# EAGLE design probe_USB_1.1 (EAGLE 9.6.2)

## Sheet 1 of 3
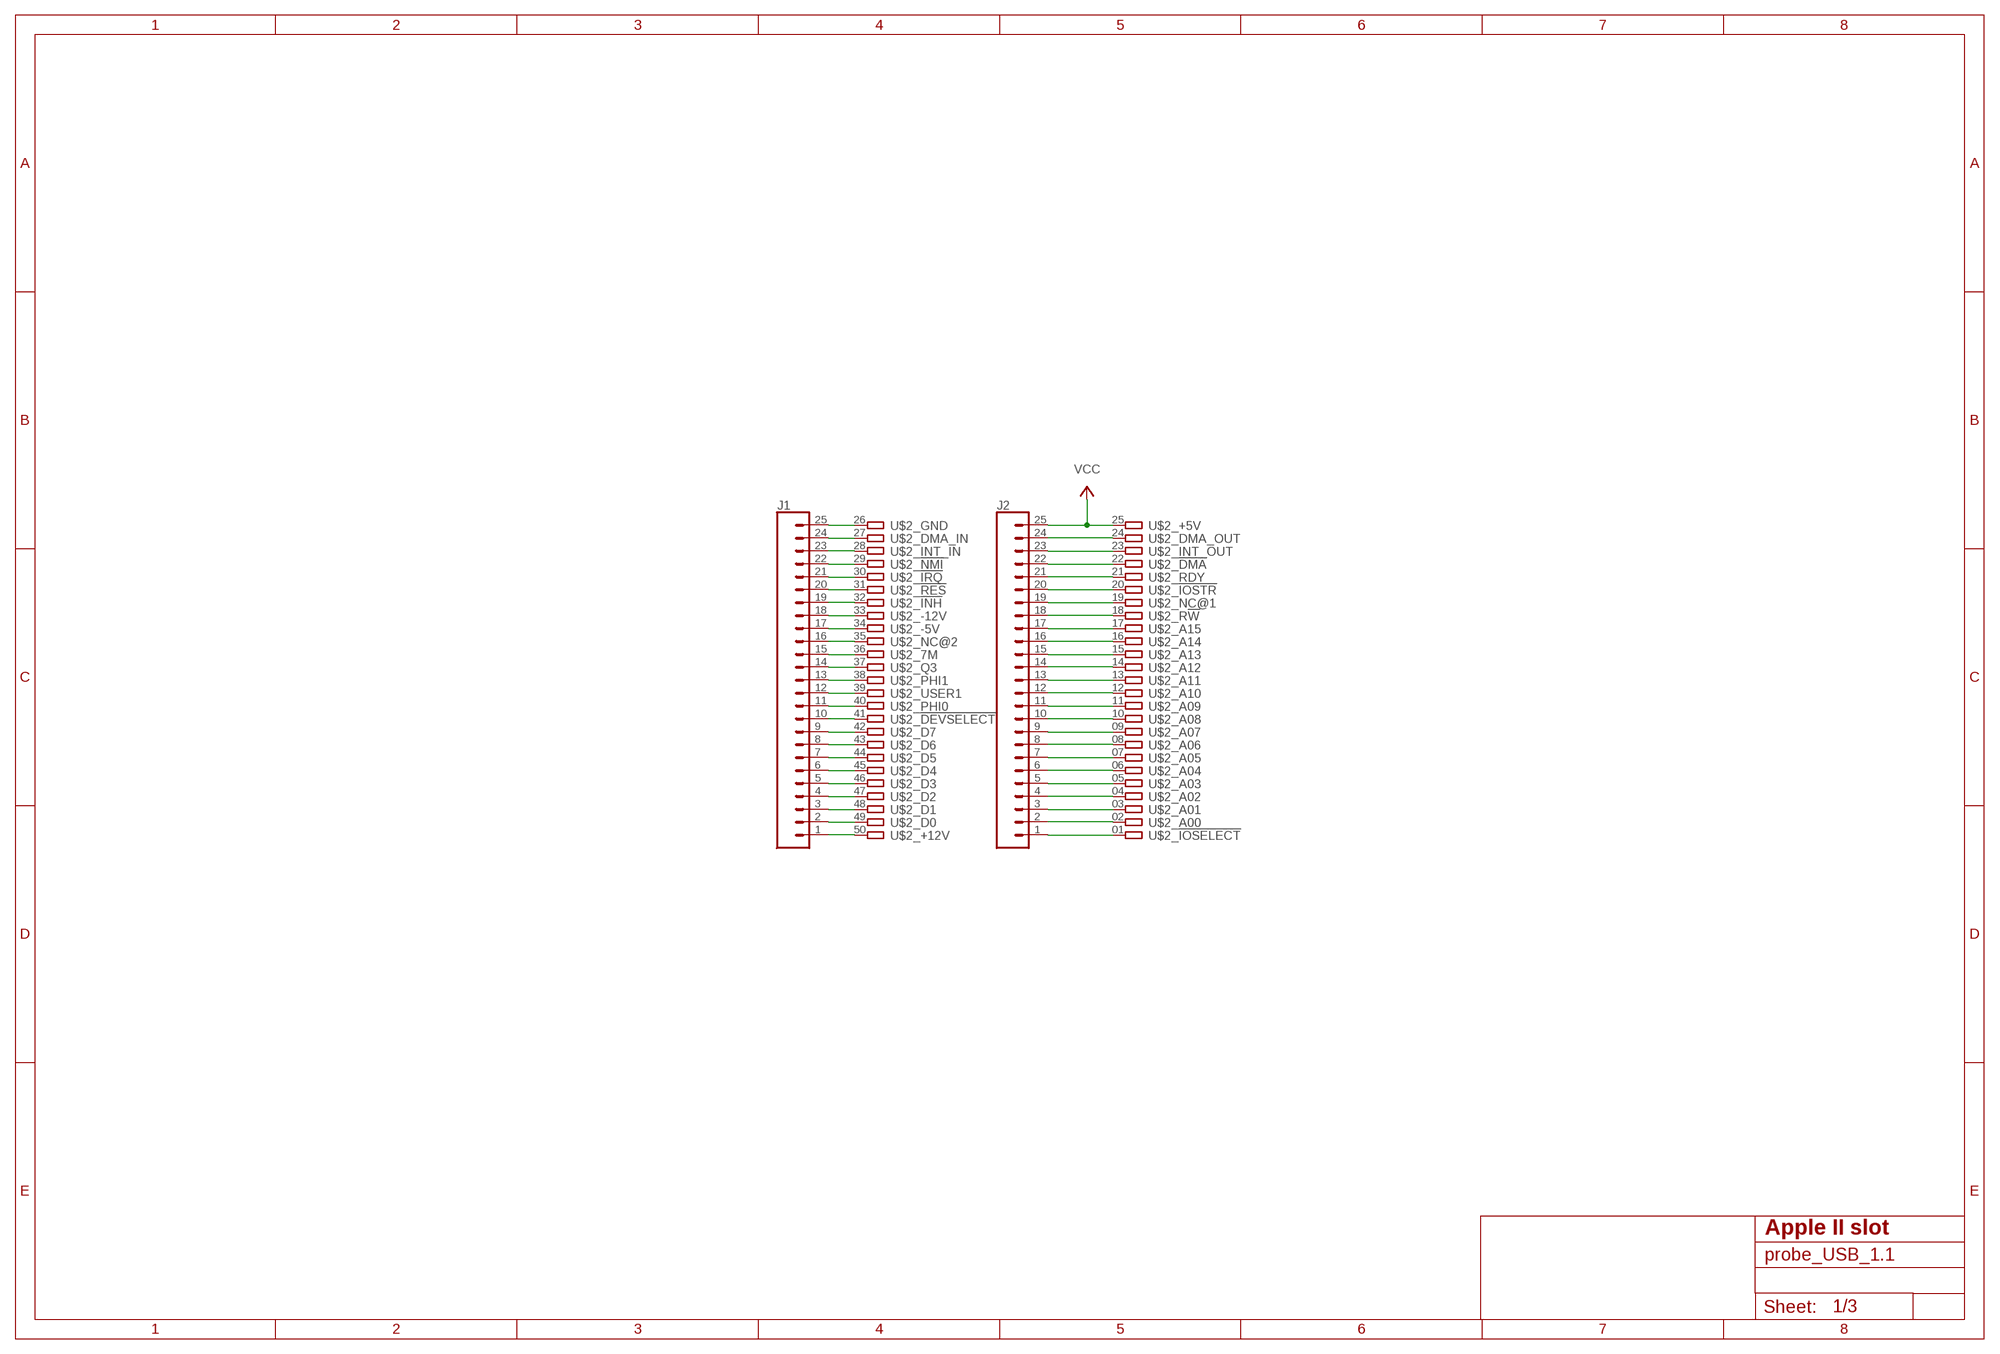
[diagram p0: schematic, sheet 1]

### Parts
J1  CONN_25PTH_LONGPADS  [1X25_LONGPAD]
J2  CONN_25PTH_LONGPADS  [1X25_LONGPAD]
U$2  A2-50PINSLOT1-3  [A2-50PIN-SL1-3]

### Nets
!CLKEN: J2.19 U$2.19
!DEV: J1.10 U$2.41 ; also sheet 3
!I/OSTROBE: J2.20 U$2.20
!IOSEL: J2.1 U$2.01 ; also sheet 3
!KBD: J1.16 U$2.35
!RES: J1.20 U$2.31 ; also sheet 3
+5V: J2.25 U$2.25 ; supply symbol labelled VCC ; also sheet 2,3
A0: J2.2 U$2.02 ; also sheet 3
A1: J2.3 U$2.03 ; also sheet 3
A2: J2.4 U$2.04 ; also sheet 3
A3: J2.5 U$2.05 ; also sheet 3
A4: J2.6 U$2.06 ; also sheet 3
A5: J2.7 U$2.07 ; also sheet 3
A6: J2.8 U$2.08 ; also sheet 3
A7: J2.9 U$2.09 ; also sheet 3
A8: J2.10 U$2.10 ; also sheet 3
A9: J2.11 U$2.11 ; also sheet 3
A10: J2.12 U$2.12 ; also sheet 3
A11: J2.13 U$2.13 ; also sheet 3
A12: J2.14 U$2.14 ; also sheet 3
A13: J2.15 U$2.15 ; also sheet 3
A14: J2.16 U$2.16 ; also sheet 3
A15: J2.17 U$2.17 ; also sheet 3
D0: J1.2 U$2.49 ; also sheet 3
D1: J1.3 U$2.48 ; also sheet 3
D2: J1.4 U$2.47 ; also sheet 3
D3: J1.5 U$2.46 ; also sheet 3
D4: J1.6 U$2.45 ; also sheet 3
D5: J1.7 U$2.44 ; also sheet 3
D6: J1.8 U$2.43 ; also sheet 3
D7: J1.9 U$2.42 ; also sheet 3
DMA_IN: J1.24 U$2.27
GND: J1.25 U$2.26 ; also sheet 2,3
INT_IN: J1.23 U$2.28
N$4: J1.22 U$2.29
N$27: J2.22 U$2.22
N$28: J2.23 U$2.23
N$29: J2.24 U$2.24
N$30: J1.21 U$2.30
N$32: J1.19 U$2.32
N$33: J1.18 U$2.33
N$34: J1.17 U$2.34
N$36: J1.15 U$2.36
N$37: J1.14 U$2.37
N$50: J1.1 U$2.50
PHI0: J1.11 U$2.40 ; also sheet 3
PHI1: J1.13 U$2.38 ; also sheet 3
R/!W: J2.18 U$2.18 ; also sheet 3
RDY: J2.21 U$2.21 ; also sheet 3
SYNC: J1.12 U$2.39 ; also sheet 3

### Notes on the sheet
- Apple II slot

## Sheet 2 of 3
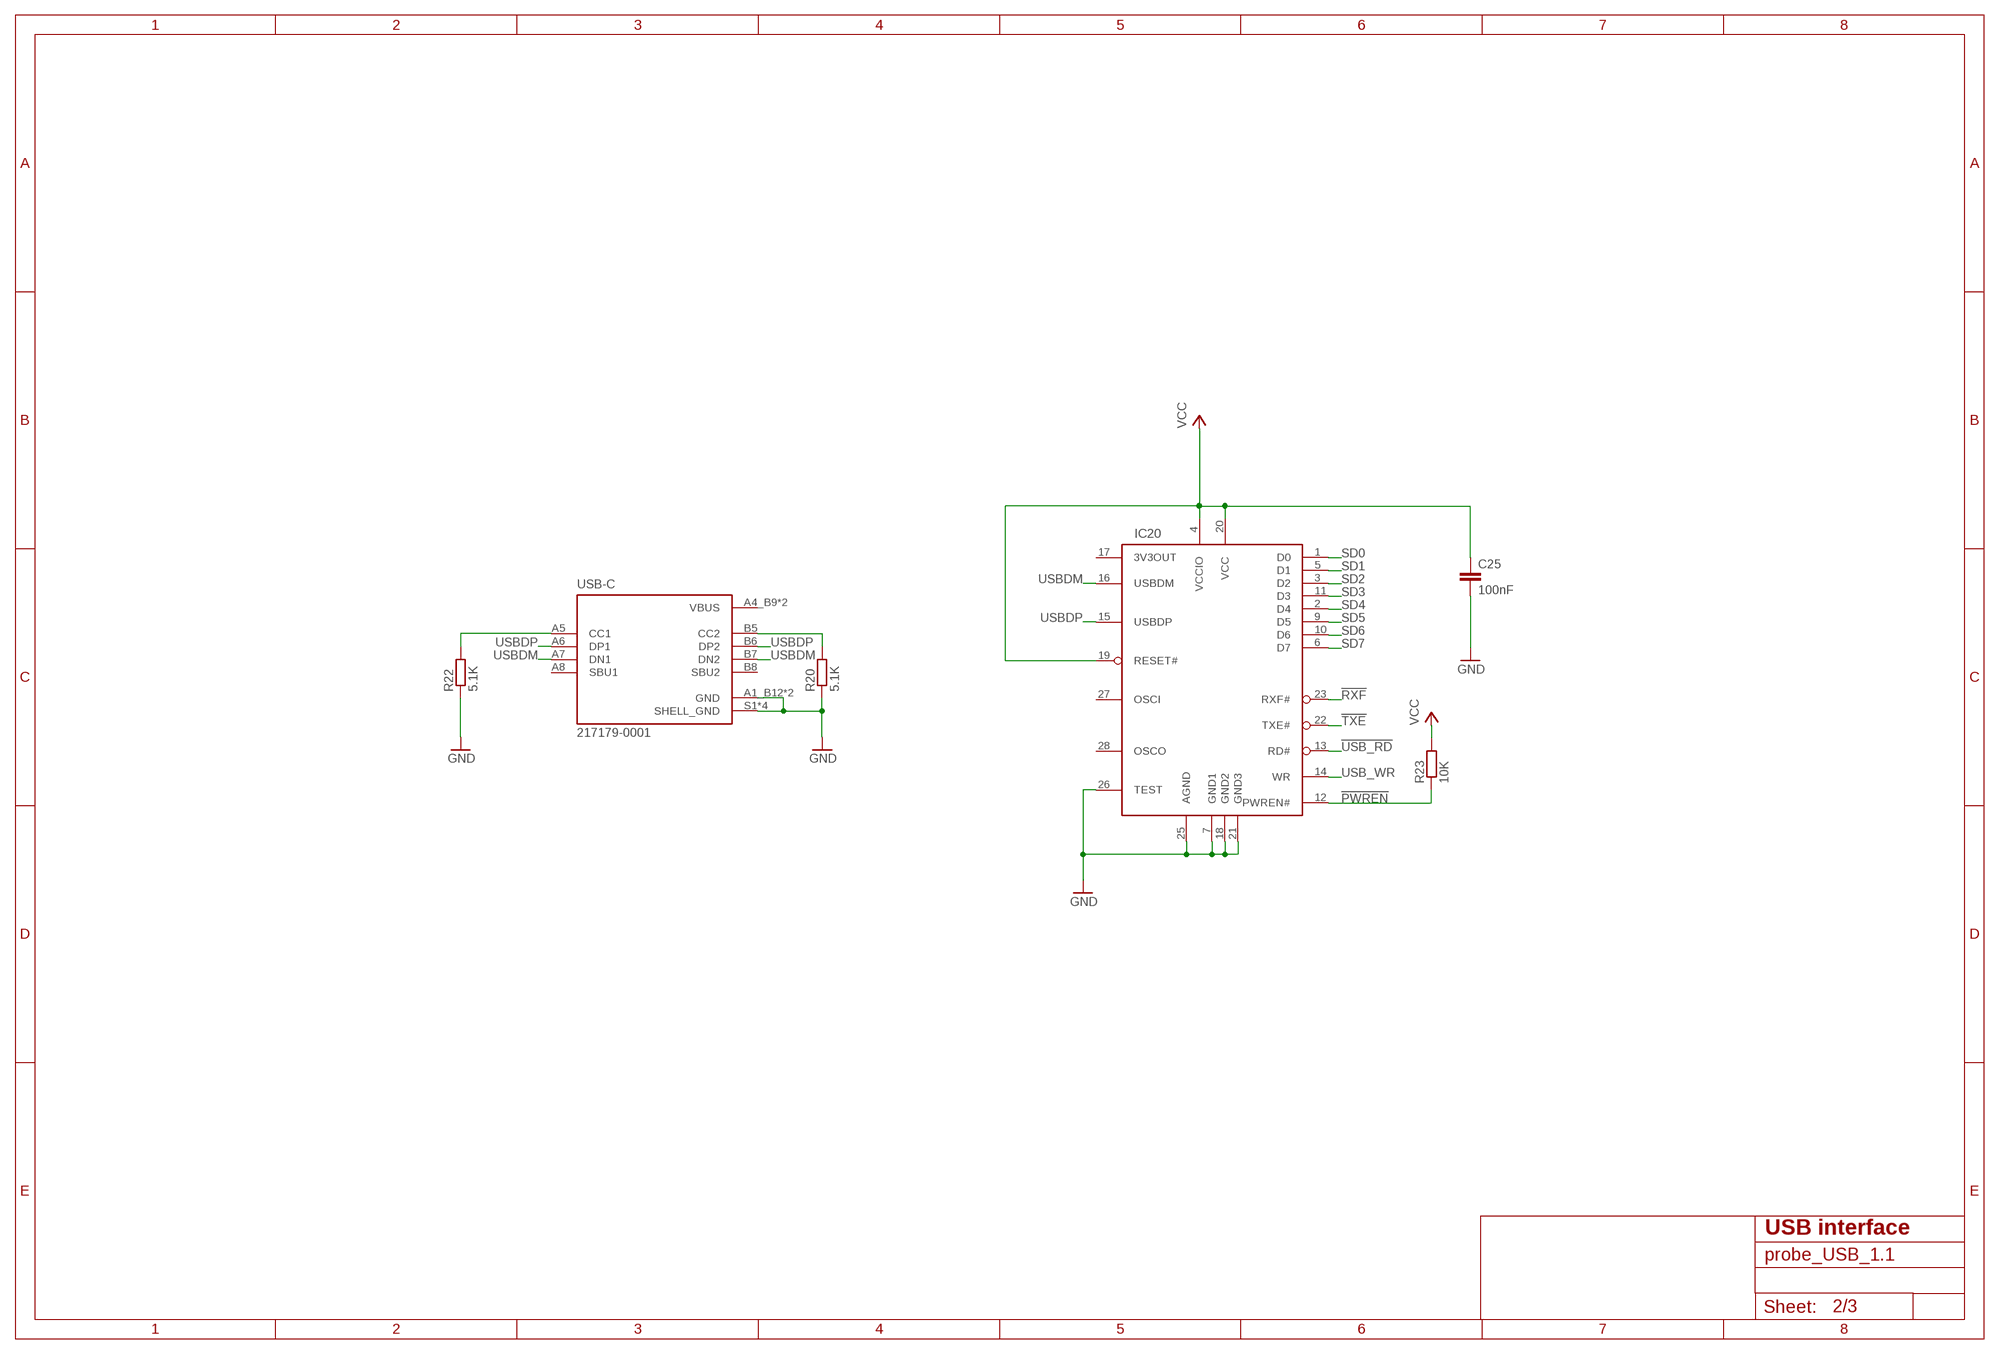
[diagram p1: schematic, sheet 2]

### Parts
C25  100nF  C-EUC0805  [C0805]
IC20  FT245RL  [SSOP28DB]
R20  5.1K  R-EU_R0805  [R0805]
R22  5.1K  R-EU_R0805  [R0805]
R23  10K  R-EU_R0805  [R0805]
USB-C  217179-0001  USB4105-GF-A  [GCT_USB4105-GF-A]

### Nets
!PWREN: IC20.12(PWREN#) R23.1
!RXF: IC20.23(RXF#) ; also sheet 3
!TXE: IC20.22(TXE#) ; also sheet 3
!USB_RD: IC20.13(RD#) ; also sheet 3
+5V: C25.1 IC20.4(VCCIO) IC20.19(RESET#) IC20.20(VCC) R23.2 ; supply symbol labelled VCC ; also sheet 1,3
GND: C25.2 IC20.7(GND1) IC20.18(GND2) IC20.21(GND3) IC20.25(AGND) IC20.26(TEST) R20.1 R22.1 USB-C.A1_B12(GND) USB-C.B1_A12(GND) USB-C.S1(SHELL_GND) USB-C.S2(SHELL_GND) USB-C.S3(SHELL_GND) USB-C.S4(SHELL_GND) ; also sheet 1,3
N$8: R22.2 USB-C.A5(CC1)
N$20: R20.2 USB-C.B5(CC2)
SD0: IC20.1(D0) ; also sheet 3
SD1: IC20.5(D1) ; also sheet 3
SD2: IC20.3(D2) ; also sheet 3
SD3: IC20.11(D3) ; also sheet 3
SD4: IC20.2(D4) ; also sheet 3
SD5: IC20.9(D5) ; also sheet 3
SD6: IC20.10(D6) ; also sheet 3
SD7: IC20.6(D7) ; also sheet 3
USB_WR: IC20.14(WR) ; also sheet 3
USBDM: IC20.16(USBDM) USB-C.A7(DN1) USB-C.B7(DN2)
USBDP: IC20.15(USBDP) USB-C.A6(DP1) USB-C.B6(DP2)
Unconnected: IC20.17(3V3OUT) IC20.27(OSCI) IC20.28(OSCO) USB-C.A8(SBU1) USB-C.B8(SBU2)

### Notes on the sheet
- USB interface

## Sheet 3 of 3
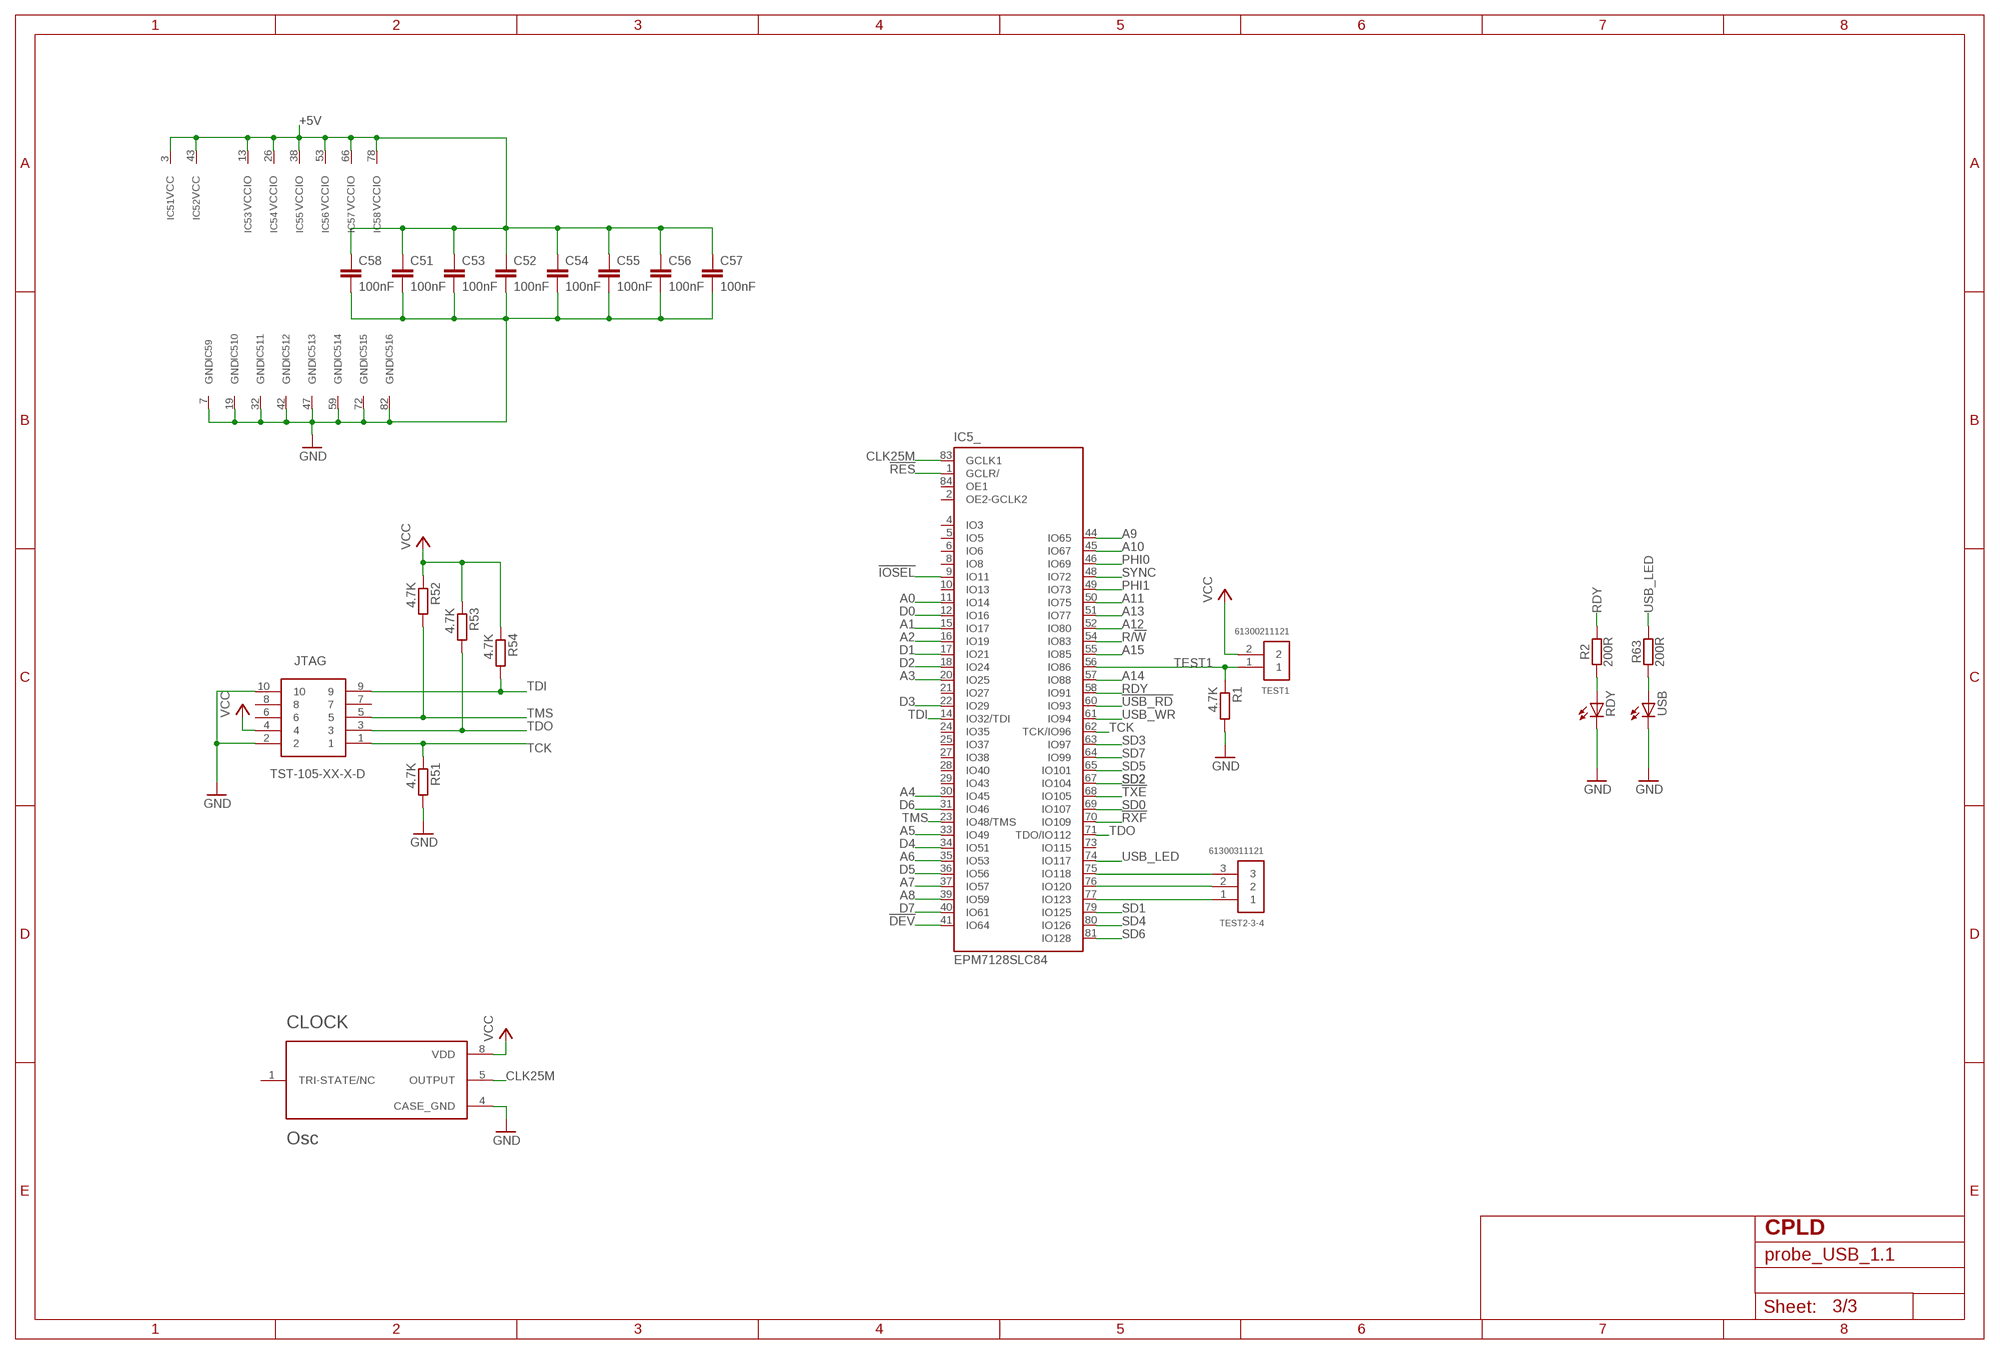
[diagram p2: schematic, sheet 3]

### Parts
C51  100nF  C-EUC0805  [C0805]
C52  100nF  C-EUC0805  [C0805]
C53  100nF  C-EUC0805  [C0805]
C54  100nF  C-EUC0805  [C0805]
C55  100nF  C-EUC0805  [C0805]
C56  100nF  C-EUC0805  [C0805]
C57  100nF  C-EUC0805  [C0805]
C58  100nF  C-EUC0805  [C0805]
CLOCK  Osc  ACH-20.000MHZ-EK  [OSC762W46P254L1270H639Q8]
IC5  EPM7128SLC84  EPM7128-SLC84-PINSPLCC84_PINS  [9404408424000000]
JTAG  TST-105-XX-X-D  [TST-105-XX-X-D]
R1  4.7K  R-EU_R0805  [R0805]
R2  200R  R-EU_R0805  [R0805]
R51  4.7K  R-EU_R0805  [R0805]
R52  4.7K  R-EU_R0805  [R0805]
R53  4.7K  R-EU_R0805  [R0805]
R54  4.7K  R-EU_R0805  [R0805]
R63  200R  R-EU_R0805  [R0805]
RDY  APTD2012LSURCK  LEDCHIP-LED0805  [CHIP-LED0805]
TEST1  61300211121  [61300211121]
TEST2-3-4  61300311121  [61300311121]
USB  APTD2012LCGCK  LEDCHIP-LED0805  [CHIP-LED0805]

### Nets
!DEV: IC5.41(_:IO64) ; also sheet 1
!IOSEL: IC5.9(_:IO11) ; also sheet 1
!RES: IC5.1(_:GCLR/) ; also sheet 1
!RXF: IC5.70(_:IO109) ; also sheet 2
!TXE: IC5.68(_:IO105) ; also sheet 2
!USB_RD: IC5.60(_:IO93) ; also sheet 2
+5V: C51.1 C52.1 C53.1 C54.1 C55.1 C56.1 C57.1 C58.1 CLOCK.8(VDD) IC5.3(1:VCC) IC5.13(3:VCCIO) IC5.26(4:VCCIO) IC5.38(5:VCCIO) IC5.43(2:VCC) IC5.53(6:VCCIO) IC5.66(7:VCCIO) IC5.78(8:VCCIO) JTAG.4 R52.1 R53.1 R54.1 TEST1.2 ; supply symbol labelled VCC ; also sheet 1,2
A0: IC5.11(_:IO14) ; also sheet 1
A1: IC5.15(_:IO17) ; also sheet 1
A2: IC5.16(_:IO19) ; also sheet 1
A3: IC5.20(_:IO25) ; also sheet 1
A4: IC5.30(_:IO45) ; also sheet 1
A5: IC5.33(_:IO49) ; also sheet 1
A6: IC5.35(_:IO53) ; also sheet 1
A7: IC5.37(_:IO57) ; also sheet 1
A8: IC5.39(_:IO59) ; also sheet 1
A9: IC5.44(_:IO65) ; also sheet 1
A10: IC5.45(_:IO67) ; also sheet 1
A11: IC5.50(_:IO75) ; also sheet 1
A12: IC5.52(_:IO80) ; also sheet 1
A13: IC5.51(_:IO77) ; also sheet 1
A14: IC5.57(_:IO88) ; also sheet 1
A15: IC5.55(_:IO85) ; also sheet 1
CLK25M: CLOCK.5(OUTPUT) IC5.83(_:GCLK1)
D0: IC5.12(_:IO16) ; also sheet 1
D1: IC5.17(_:IO21) ; also sheet 1
D2: IC5.18(_:IO24) ; also sheet 1
D3: IC5.22(_:IO29) ; also sheet 1
D4: IC5.34(_:IO51) ; also sheet 1
D5: IC5.36(_:IO56) ; also sheet 1
D6: IC5.31(_:IO46) ; also sheet 1
D7: IC5.40(_:IO61) ; also sheet 1
GND: C51.2 C52.2 C53.2 C54.2 C55.2 C56.2 C57.2 C58.2 CLOCK.4(CASE_GND) IC5.7(9:GND) IC5.19(10:GND) IC5.32(11:GND) IC5.42(12:GND) IC5.47(13:GND) IC5.59(14:GND) IC5.72(15:GND) IC5.82(16:GND) JTAG.2 JTAG.10 R1.2 R51.2 RDY.C USB.C ; also sheet 1,2
N$1: IC5.75(_:IO118) TEST2-3-4.3
N$2: R2.1 RDY.A
N$3: IC5.76(_:IO120) TEST2-3-4.2
N$5: IC5.77(_:IO123) TEST2-3-4.1
N$10: R63.1 USB.A
PHI0: IC5.46(_:IO69) ; also sheet 1
PHI1: IC5.49(_:IO73) ; also sheet 1
R/!W: IC5.54(_:IO83) ; also sheet 1
RDY: IC5.58(_:IO91) R2.2 ; also sheet 1
SD0: IC5.69(_:IO107) ; also sheet 2
SD1: IC5.79(_:IO125) ; also sheet 2
SD2: IC5.67(_:IO104) ; also sheet 2
SD3: IC5.63(_:IO97) ; also sheet 2
SD4: IC5.80(_:IO126) ; also sheet 2
SD5: IC5.65(_:IO101) ; also sheet 2
SD6: IC5.81(_:IO128) ; also sheet 2
SD7: IC5.64(_:IO99) ; also sheet 2
SYNC: IC5.48(_:IO72) ; also sheet 1
TCK: IC5.62(_:TCK/IO96) JTAG.1 R51.1
TDI: IC5.14(_:IO32/TDI) JTAG.9 R54.2
TDO: IC5.71(_:TDO/IO112) JTAG.3 R53.2
TEST1: IC5.56(_:IO86) R1.1 TEST1.1
TMS: IC5.23(_:IO48/TMS) JTAG.5 R52.2
USB_LED: IC5.74(_:IO117) R63.2
USB_WR: IC5.61(_:IO94) ; also sheet 2
Unconnected: CLOCK.1(TRI-STATE/NC) IC5.2(_:OE2-GCLK2) IC5.4(_:IO3) IC5.5(_:IO5) IC5.6(_:IO6) IC5.8(_:IO8) IC5.10(_:IO13) IC5.21(_:IO27) IC5.24(_:IO35) IC5.25(_:IO37) IC5.27(_:IO38) IC5.28(_:IO40) IC5.29(_:IO43) IC5.73(_:IO115) IC5.84(_:OE1) JTAG.6 JTAG.7 JTAG.8

### Notes on the sheet
- CPLD

## Power pins joined to a net without a drawn wire
VBUS: USB-C.A4_B9(VBUS) USB-C.B4_A9(VBUS)

## Library data of the parts
C25 C51-C58 = rcl:C-EU: CAPACITOR, European symbol; SPICEPREFIX: C
CLOCK = ACH-20.000MHZ-EK:ACH-20.000MHZ-EK: Oscillator XO 20MHz A±30ppm 15pF (Stability) HCMOS/TTL 55% 5V 4-Pin Metal DIP Thru-Hole Tube Check prices <https://pricing.snapeda.com/search/part/ACH-20.000MHZ-EK/?ref=eda>; AVAILABILITY: Warning; DESCRIPTION: 20MHz XO (Standard) HCMOS, TTL Oscillator 5V Enable/Disable 8-DIP, 4 Leads (Half Size, Metal Can); MF: Abracon LLC; MP: ACH-20.000MHZ-EK; PACKAGE: DIP-8 Abracon LLC; PRICE: None; PURCHASE-URL: https://pricing.snapeda.com/search/part/ACH-20.000MHZ-EK/?ref=eda
IC5 = altera_kris:EPM7128-SLC84-PINS: EPM70128 MAX 7000 family
IC20 = FT245RL:FT245RL: USB FIFO Controller 4th Generation USB Controller (USB <-> Parallel) - FIFO; AVAILABILITY: Unavailable; DESCRIPTION: USB Bridge, USB to FIFO USB 2.0 FIFO Interface 28-SSOP; MF: FTDI, Future; MP: FT245RL; PACKAGE: SSOP-28 FTDI; PRICE: None
J1 J2 = SparkFun-Connectors:CONN_25: Multi connection point. Often used as Generic Header-pin footprint for 0.1 inch spaced/style header connections On any of the 0.1 inch spaced packages, you can populate with these: Break Away Headers - Straight <https://www.sparkfun.com/products/116> (PRT-00116) Break Away Male Headers - Right Angle <https://www.sparkfun.com/products/553> (PRT-00553) Female Headers <https://www.sparkfun.com/products/115> (PRT-00115) Break Away Headers - Machine Pin <https://www.sparkfun.com/products/117> (PRT-00117) Break Away Female Headers - Swiss Machine Pin <https://www.sparkfun.com/products/743> (PRT-00743) For SCREWTERMINALS and SPRING TERMINALS visit here: Screw Terimnals on SparkFun.com <https://www.sparkfun.com/search/results?term=Screw+Terminals> (5mm/3.5mm/2.54mm spacing) This device is also useful as a general connection point to wire up your design to another part of your project. Our various solder wires solder well into these plated through hole pads. Hook-Up Wire - Assortment (Stranded, 22 AWG) <https://www.sparkfun.com/products/11375> (PRT-11375) Hook-Up Wire - Assortment (Solid Core, 22 AWG) <https://www.sparkfun.com/products/11367> (PRT-11367) View the entire wire category on our website here <https://www.sparkfun.com/categories/141> Special notes: Molex polarized connector foot print use with SKU : PRT-08231 with associated crimp pins and housings. 1MM SMD Version SKU: PRT-10208 NOTES ON THE VARIANTS LOCK and LOCK_LONGPADS... This footprint was designed to help hold the alignment of a through-hole component (i.e. 6-pin header) while soldering it into place. You may notice that each hole has been shifted either up or down by 0.005 of an inch from it's more standard position (which is a perfectly straight line). This slight alteration caused the pins (the squares in the middle) to touch the edges of the holes. Because they are alternating, it causes a "brace" to hold the component in place. 0.005 has proven to be the perfect amount of "off-center" position when using our standard breakaway headers. Although looks a little odd when you look at the bare footprint, once you have a header in there, the alteration is very hard to notice. Also,if you push a header all the way into place, it is covered up entirely on the bottom side.
JTAG = TST-105-XX-X-D:TST-105-XX-X-D: 0.100" TOP SHROUD TERMINAL STRIP. MANUFACTURER: SAMTEC. Check prices <https://pricing.snapeda.com/parts/TST-105-03-G-D/Samtec/view-part?ref=eda>; AVAILABILITY: Warning; DESCRIPTION: Connector Header Through Hole 10 position 0.100 (2.54mm); MF: Samtec; MP: TST-105-03-G-D; PACKAGE: None; PRICE: None; PURCHASE-URL: https://pricing.snapeda.com/search/part/TST-105-03-G-D/?ref=eda
R1 R2 R20 R22 R23 R51-R54 R63 = rcl:R-EU_: RESISTOR, European symbol; SPICEPREFIX: R
RDY USB = adafruit:LED: LED OSRAM: - CHIPLED LG R971, LG N971, LY N971, LG Q971, LY Q971, LO R971, LY R971 LH N974, LH R974 LS Q976, LO Q976, LY Q976 LO Q996 - Hyper CHIPLED LW Q18S LB Q993, LB Q99A, LB R99A - SideLED LS A670, LO A670, LY A670, LG A670, LP A670 LB A673, LV A673, LT A673, LW A673 LH A674 LY A675 LS A676, LA A676, LO A676, LY A676, LW A676 LS A679, LY A679, LG A679 - Hyper Micro SIDELED® LS Y876, LA Y876, LO Y876, LY Y876 LT Y87S - SmartLED LW L88C, LW L88S LB L89C, LB L89S, LG L890 LS L89K, LO L89K, LY L89K LS L896, LA L896, LO L896, LY L896 - TOPLED LS T670, LO T670, LY T670, LG T670, LP T670 LSG T670, LSP T670, LSY T670, LOP T670, LYG T670 LG T671, LOG T671, LSG T671 LB T673, LV T673, LT T673, LW T673 LH T674 LS T676, LA T676, LO T676, LY T676, LB T676, LH T676, LSB T676, LW T676 LB T67C, LV T67C, LT T67C, LS T67K, LO T67K, LY T67K, LW E67C LS E67B, LA E67B, LO E67B, LY E67B, LB E67C, LV E67C, LT E67C LW T67C LS T679, LY T679, LG T679 LS T770, LO T770, LY T770, LG T770, LP T770 LB T773, LV T773, LT T773, LW T773 LH T774 LS E675, LA E675, LY E675, LS T675 LS T776, LA T776, LO T776, LY T776, LB T776 LHGB T686 LT T68C, LB T68C - Hyper Mini TOPLED® LB M676 - Mini TOPLED Santana® LG M470 LS M47K, LO M47K, LY M47K Source: http://www.osram.convergy.de/
TEST1 = Headers:61300211121: CONN HEADER VERT 2POS 2.54MM Manufacturer's datasheet <https://katalog.we-online.de/em/datasheet/6130xx11121.pdf>; CREATED_BY: PCBLayout.com; DIGI_KEY_PART_NUMBER: 732-5315-ND; MANUFACTURER: Wurth Electronics Inc.; MPN: 61300211121
TEST2-3-4 = Headers:61300311121: CONN HEADER VERT 3POS 2.54MM Manufacturer's datasheet <https://katalog.we-online.de/em/datasheet/6130xx11121.pdf>; CREATED_BY: PCBLayout.com; DIGI_KEY_PART_NUMBER: 732-5316-ND; MANUFACTURER: Wurth Electronics Inc.; MPN: 61300311121
U$2 = con-apple2:A2-50PIN: Apple ][ Peripheral Card Connector This is the, default, 50-pin connector for slot #1 to #7 Pins are laid out as seen from the top of the slot
USB-C = USB4105-GF-A:USB4105-GF-A: USB-C (USB TYPE-C) USB 2.0 Receptacle Connector 24 (16+8 Dummy) Position Surface Mount, Right Angle; Through Hole Check prices <https://pricing.snapeda.com/parts/USB4105-GF-A/GCT/view-part?ref=eda>; AVAILABILITY: Warning; DESCRIPTION: USB-C (USB TYPE-C) USB 2.0 Receptacle Connector 24 (16+8 Dummy) Position Surface Mount, Right Angle; Through Hole; MF: GCT; MP: USB4105-GF-A; PACKAGE: None; PRICE: None; PURCHASE-URL: https://pricing.snapeda.com/search/part/USB4105-GF-A/?ref=eda

## Net classes
0 default: width 0.152 mm

## Board
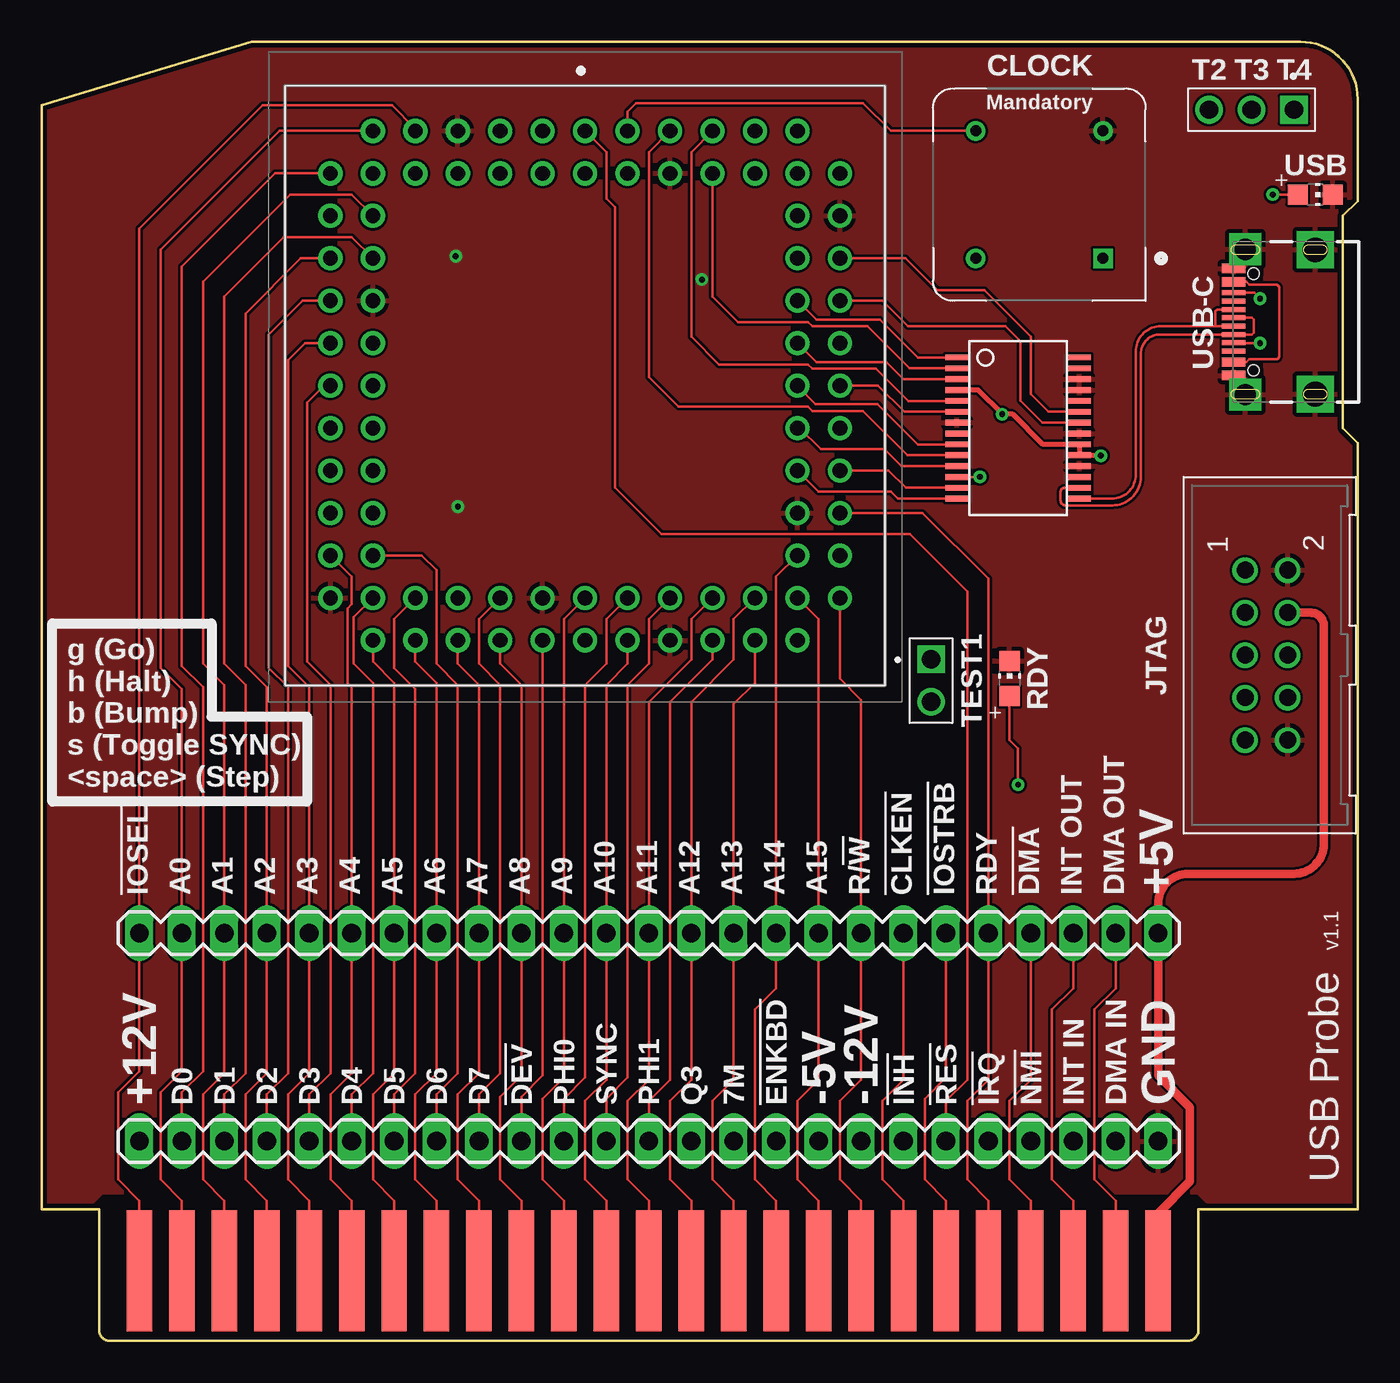
[diagram p3: board, top side]
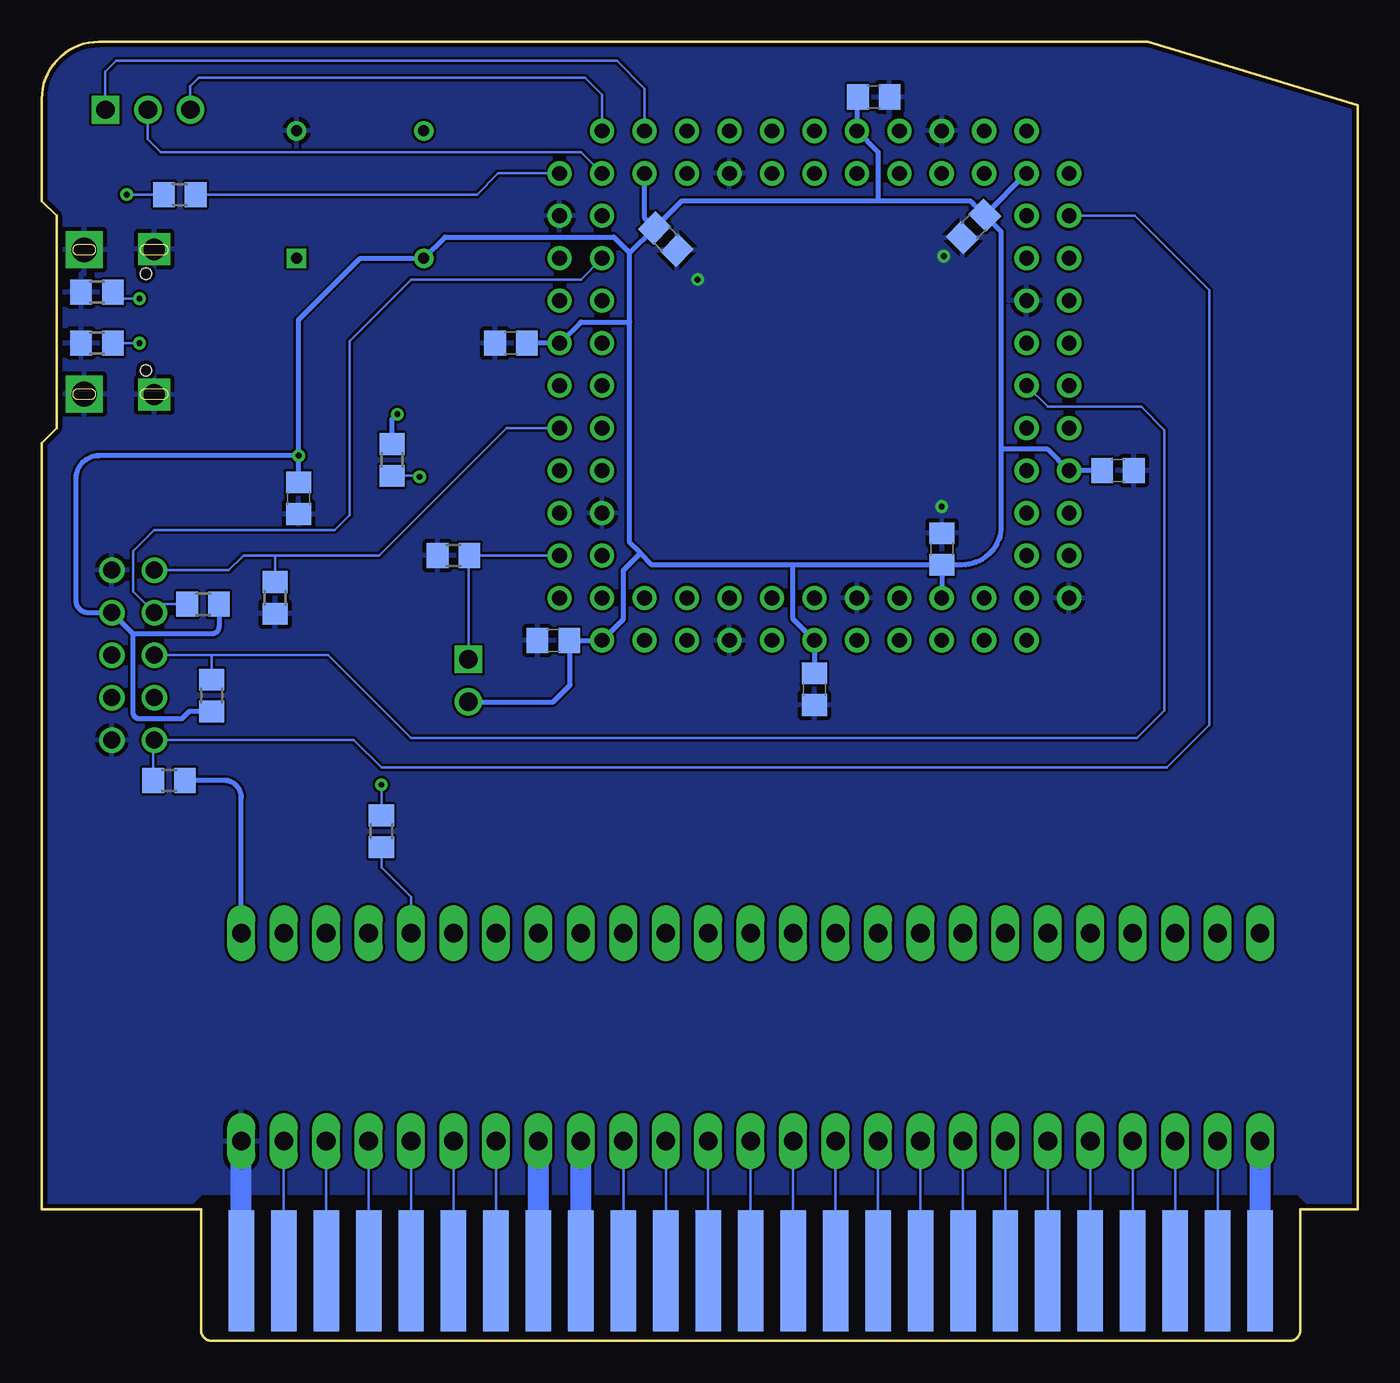
[diagram p4: board, bottom side, seen from below]

Size 78.74 x 77.72 mm. Coordinates in mm from the lower left corner, seen from the top.
Outline: 0,7.87 0,73.91 12.57,77.72 75.31,77.72 arc-90 78.74,74.3 78.74,68.2 77.85,67.31 77.85,54.61 78.74,53.72 78.74,7.87 69.22,7.87 69.22,0.64 arc-90 68.58,0 4.06,0 arc-90 3.43,0.64 3.43,7.87 0,7.87
Copper layers (1*16): Top 0.035mm / dielectric 1.5mm / Bottom 0.035mm
Design rules "default *": minimum track width 6mil, minimum drill 0.35mm, track to track 6mil, track to pad 6mil, pad to pad 6mil, via to via 6mil, smd to smd 6mil, copper to edge 10mil, drill to drill 6mil, minimum pad ring 10mil, minimum via ring 8mil, stop-mask expansion 4mil, vias tented up to drill 0mil, thermal gap 10mil

### Footprints (pad centres in the part's own frame; a part is rotated, then mirrored left to right if it is on the bottom)
C0805 = smd 1.3 x 1.5: 1 -0.95,0; 2 0.95,0
OSC762W46P254L1270H639Q8 = drill 0.66 square: 1 -3.81,3.81 | drill 0.66: 4 -3.81,-3.81; 5 3.81,-3.81; 8 3.81,3.81
9404408424000000 = drill 0.889 pad 1.445: 1 0,0; 2 0,-2.54; 3 -2.54,0; 4 -2.54,-2.54; 5 -5.08,0; 6 -5.08,-2.54; 7 -7.62,0; 8 -7.62,-2.54; 9 -10.16,0; 10 -10.16,-2.54; 11 -12.7,0; 12 -15.24,-2.54; 13 -12.7,-2.54; 14 -15.24,-5.08; 15 -12.7,-5.08; 16 -15.24,-7.62; 17 -12.7,-7.62; 18 -15.24,-10.16; 19 -12.7,-10.16; 20 -15.24,-12.7; 21 -12.7,-12.7; 22 -15.24,-15.24; 23 -12.7,-15.24; 24 -15.24,-17.78; 25 -12.7,-17.78; 26 -15.24,-20.32; 27 -12.7,-20.32; 28 -15.24,-22.86; 29 -12.7,-22.86; 30 -15.24,-25.4; 31 -12.7,-25.4; 32 -15.24,-27.94; 33 -12.7,-30.48; 34 -12.7,-27.94; 35 -10.16,-30.48; 36 -10.16,-27.94; 37 -7.62,-30.48; 38 -7.62,-27.94; 39 -5.08,-30.48; 40 -5.08,-27.94; 41 -2.54,-30.48; 42 -2.54,-27.94; 43 0,-30.48; 44 0,-27.94; 45 2.54,-30.48; 46 2.54,-27.94; 47 5.08,-30.48; 48 5.08,-27.94; 49 7.62,-30.48; 50 7.62,-27.94; 51 10.16,-30.48; 52 10.16,-27.94; 53 12.7,-30.48; 54 15.24,-27.94; 55 12.7,-27.94; 56 15.24,-25.4; 57 12.7,-25.4; 58 15.24,-22.86; 59 12.7,-22.86; 60 15.24,-20.32; 61 12.7,-20.32; 62 15.24,-17.78; 63 12.7,-17.78; 64 15.24,-15.24; 65 12.7,-15.24; 66 15.24,-12.7; 67 12.7,-12.7; 68 15.24,-10.16; 69 12.7,-10.16; 70 15.24,-7.62; 71 12.7,-7.62; 72 15.24,-5.08; 73 12.7,-5.08; 74 15.24,-2.54; 75 12.7,0; 76 12.7,-2.54; 77 10.16,0; 78 10.16,-2.54; 79 7.62,0; 80 7.62,-2.54; 81 5.08,0; 82 5.08,-2.54; 83 2.54,0; 84 2.54,-2.54
SSOP28DB = smd 0.348 x 1.397: 1 -4.225,-3.656; 2 -3.575,-3.656; 3 -2.925,-3.656; 4 -2.275,-3.656; 5 -1.625,-3.656; 6 -0.975,-3.656; 7 -0.325,-3.656; 8 0.325,-3.656; 9 0.975,-3.656; 10 1.625,-3.656; 11 2.275,-3.656; 12 2.925,-3.656; 13 3.575,-3.656; 14 4.225,-3.656; 15 4.225,3.656; 16 3.575,3.656; 17 2.925,3.656; 18 2.275,3.656; 19 1.625,3.656; 20 0.975,3.656; 21 0.325,3.656; 22 -0.325,3.656; 23 -0.975,3.656; 24 -1.625,3.656; 25 -2.275,3.656; 26 -2.925,3.656; 27 -3.575,3.656; 28 -4.225,3.656
1X25_LONGPAD = drill 1.118 long: 1 0,0; 2 2.54,0; 3 5.08,0; 4 7.62,0; 5 10.16,0; 6 12.7,0; 7 15.24,0; 8 17.78,0; 9 20.32,0; 10 22.86,0; 11 25.4,0; 12 27.94,0; 13 30.48,0; 14 33.02,0; 15 35.56,0; 16 38.1,0; 17 40.64,0; 18 43.18,0; 19 45.72,0; 20 48.26,0; 21 50.8,0; 22 53.34,0; 23 55.88,0; 24 58.42,0; 25 60.96,0
TST-105-XX-X-D = drill 1.016 pad 1.524: 1 -5.08,-1.27; 2 -5.08,1.27; 3 -2.54,-1.27; 4 -2.54,1.27; 5 0,-1.27; 6 0,1.27; 7 2.54,-1.27; 8 2.54,1.27; 9 5.08,-1.27; 10 5.08,1.27
R0805 = smd 1.3 x 1.5: 1 -0.95,0; 2 0.95,0
CHIP-LED0805 = smd 1.2 x 1.2: A 0,-1.05; C 0,1.05
61300211121 = drill 1.1 square: 1 -1.27,0 | drill 1.1: 2 1.27,0
61300311121 = drill 1.1 square: 1 -2.54,0 | drill 1.1: 2 0,0; 3 2.54,0
A2-50PIN-SL1-3 = smd 1.524 x 7.239: 01 -73.025,4.064; 02 -70.485,4.064; 03 -67.945,4.064; 04 -65.405,4.064; 05 -62.865,4.064; 06 -60.325,4.064; 07 -57.785,4.064; 08 -55.245,4.064; 09 -52.705,4.064; 10 -50.165,4.064; 11 -47.625,4.064; 12 -45.085,4.064; 13 -42.545,4.064; 14 -40.005,4.064; 15 -37.465,4.064; 16 -34.925,4.064; 17 -32.385,4.064; 18 -29.845,4.064; 19 -27.305,4.064; 20 -24.765,4.064; 21 -22.225,4.064; 22 -19.685,4.064; 23 -17.145,4.064; 24 -14.605,4.064; 25 -12.065,4.064 | smd 1.524 x 7.239 bottom: 26 -12.065,4.064; 27 -14.605,4.064; 28 -17.145,4.064; 29 -19.685,4.064; 30 -22.225,4.064; 31 -24.765,4.064; 32 -27.305,4.064; 33 -29.845,4.064; 34 -32.385,4.064; 35 -34.925,4.064; 36 -37.465,4.064; 37 -40.005,4.064; 38 -42.545,4.064; 39 -45.085,4.064; 40 -47.625,4.064; 41 -50.165,4.064; 42 -52.705,4.064; 43 -55.245,4.064; 44 -57.785,4.064; 45 -60.325,4.064; 46 -62.865,4.064; 47 -65.405,4.064; 48 -67.945,4.064; 49 -70.485,4.064; 50 -73.025,4.064
GCT_USB4105-GF-A = smd 0.549 x 1.404: A1_B12 -3.2,4.882; A4_B9 -2.4,4.882; B1_A12 3.2,4.882; B4_A9 2.4,4.882 | smd 0.3 x 1.404: A5 -1.25,4.882; A6 -0.25,4.882; A7 0.25,4.882; A8 1.25,4.882; B5 1.75,4.882; B6 0.75,4.882; B7 -0.75,4.882; B8 -1.75,4.882 | drill 1.27 pad 1.321 square: S1 -4.345,4.18; S4 4.345,4.18 | drill 1.473 pad 1.524 square: S2 -4.32,0; S3 4.32,0 | hole 0.65: 2.89,3.68; -2.89,3.68

### Placement (x,y rotation side)
C25  63.37,50.42 270 bottom
C51  32.51,38.99 270 bottom
C52  41.4,65.91 315 bottom
C53  28.96,74.42 0 bottom
C54  22.99,66.67 225 bottom
C55  14.35,52.07 0 bottom
C56  48.13,41.91 180 bottom
C57  50.67,59.69 180 bottom
C58  24.89,47.37 90 bottom
CLOCK  59.69,68.58 180 top
IC5  32.51,72.39 0 top
IC20  58.42,54.61 270 top
J1  5.84,11.94 0 top
J2  5.84,24.38 0 top
JTAG  73.28,41.02 270 top
R1  54.1,46.99 180 bottom
R2  58.42,30.48 270 bottom
R20  75.44,62.74 0 bottom
R22  75.44,59.69 0 bottom
R23  57.78,52.7 90 bottom
R51  64.77,44.45 270 bottom
R52  68.58,38.61 90 bottom
R53  69.09,44.07 180 bottom
R54  71.12,33.53 180 bottom
R63  70.48,68.58 0 bottom
RDY  57.91,39.62 0 top
TEST1  53.21,39.5 270 top
TEST2-3-4  72.39,73.66 180 top
U$2  78.87,0.13 0 top
USB  76.2,68.58 270 top
USB-C  76.2,60.96 90 top

### Tracks (layer width: path | path; a pad name or v marks a point on that pad's centre or on a via)
!CLKEN
  Top 0.152: J2.19 51.56,15.62 50.29,14.35 50.29,9.65 51.56,8.38 U$2.19
!DEV
  Top 0.152: J1.10 28.7,14.61 29.97,15.88 IC5.41
  Bottom 0.152: U$2.41 J1.10
!I/OSTROBE
  Top 0.152: J2.20 54.1,15.75 52.83,14.48 52.83,9.65 54.1,8.38 U$2.20
!IOSEL
  Top 0.152: U$2.01 5.84,8.38 4.57,9.65 4.57,14.86 5.84,16.13 J2.1 5.84,66.55 13.21,73.91 20.95,73.91 22.35,72.52 IC5.9
!KBD
  Bottom 0.152: U$2.35 J1.16
!PWREN  (via drill 0.35)
  Top 0.152: IC20.12 v56.13,51.69
  Bottom 0.152: v56.13,51.69 56.2,51.76 R23.1
!RES
  Top 0.152: J1.20 54.1,14.35 55.37,15.62 55.37,44.83 51.94,48.26 37.08,48.26 34.29,51.05 34.29,67.82 33.78,68.33 33.78,71.12 IC5.1
  Bottom 0.152: U$2.31 J1.20
!RXF
  Top 0.152: IC20.23 60.24,55.59 59.18,56.64 59.18,60.07 56.39,62.87 53.59,62.87 51.69,64.77 IC5.70
!TXE
  Top 0.152: IC20.22 59.87,54.94 58.55,56.26 58.55,59.82 57.66,60.71 51.82,60.71 50.29,62.23 IC5.68
!USB_RD
  Top 0.152: IC20.13 51.71,51.03 50.67,52.07 IC5.60
+5V  (via drill 0.35)
  Top 0.305: v63.37,52.96 63.35,52.98 IC20.19 IC20.20 59.9,53.63 58.1,55.44 v57.47,55.44 56.02,56.88 IC20.4
  Top 0.508: U$2.25 66.8,7.62 68.71,9.53 68.71,13.97 66.8,15.88 J2.25 66.8,26.16 arc-90 68.58,27.94 74.93,27.94 arc90 76.71,29.72 76.71,42.8 arc90 75.95,43.56 JTAG.4
  Bottom 0.305: C53.1 29.97,74.36 IC5.3 28.7,71.12 28.7,68.2 | IC5.13 C54.1 | C58.1 IC5.38 | C51.1 IC5.43 33.78,43.18 33.78,46.42 | C57.1 IC5.66 46.48,60.96 43.56,60.96 | C55.1 IC5.26 18.54,53.34 21.34,53.34 | C54.1 21.34,66.37 21.34,53.34 | C58.1 23.68,46.42 arc-90 21.34,48.77 21.34,53.34 | C58.1 33.78,46.42 | 33.78,46.42 42.23,46.42 42.93,47.12 | 43.56,65.1 C52.1 | 42.93,47.12 43.56,47.75 43.56,60.96 | 43.56,60.96 43.56,65.1 | C54.1 23.17,68.2 28.7,68.2 | C52.1 40.46,68.2 28.7,68.2 | C52.1 42.67,67.18 IC5.78 | 42.93,47.12 43.94,46.1 43.94,43.18 IC5.53 C56.1 47.12,41.84 47.12,39.24 48.13,38.23 TEST1.2 | v63.37,52.96 75.31,52.96 arc-90 76.71,51.56 76.71,44.32 arc-90 75.95,43.56 JTAG.4 73.28,42.29 | 43.56,65.1 44.5,66.04 54.61,66.04 CLOCK.8 59.69,64.77 63.37,61.09 v63.37,52.96 | C25.1 v63.37,52.96 | J2.25 66.8,32.51 arc-90 67.82,33.53 R54.1 | R52.1 69.91,37.66 70.36,37.21 72.9,37.21 arc90 73.28,37.59 73.28,42.29 | R53.1 68.14,42.73 arc90 68.58,42.29 73.28,42.29 | R23.2 57.78,55.12 v57.47,55.44
A0
  Top 0.152: U$2.02 8.38,8.38 7.11,9.65 7.11,14.86 8.38,16.13 J2.2 8.38,38.99 7.11,40.26 7.11,65.28 14.22,72.39 IC5.11
A1
  Top 0.152: U$2.03 10.92,8.38 9.65,9.65 9.65,14.73 10.92,16 J2.3 10.92,39.24 9.65,40.51 9.65,63.37 14.86,68.58 18.54,68.58 IC5.15
A2
  Top 0.152: U$2.04 13.46,8.38 12.19,9.65 12.19,14.73 13.46,16 J2.4 13.46,39.12 12.19,40.39 12.19,61.47 15.49,64.77 IC5.16
A3
  Top 0.152: U$2.05 16,8.38 14.73,9.65 14.73,14.73 16,16 J2.5 16,39.12 14.73,40.39 14.73,58.67 15.75,59.69 IC5.20
A4
  Top 0.152: U$2.06 18.54,8.38 17.27,9.65 17.27,14.73 18.54,16 J2.6 18.54,39.12 18.29,39.37 18.29,43.81 18.54,44.07 18.54,45.72 IC5.30
A5
  Top 0.152: U$2.07 21.08,8.38 19.81,9.65 19.81,14.73 21.08,16 J2.7 21.08,39.37 19.81,40.64 IC5.33
A6
  Top 0.152: U$2.08 23.62,8.38 22.35,9.65 22.35,14.73 23.62,16 J2.8 23.62,39.37 22.35,40.64 IC5.35
A7
  Top 0.152: U$2.09 26.16,8.38 24.89,9.65 24.89,14.73 26.16,16 J2.9 26.16,39.24 24.89,40.51 IC5.37
A8
  Top 0.152: U$2.10 28.7,8.38 27.43,9.65 27.43,14.61 28.7,15.88 J2.10 28.7,39.24 27.43,40.51 IC5.39
A9
  Top 0.152: U$2.11 31.24,8.38 29.97,9.65 29.97,14.48 31.24,15.75 J2.11 31.24,43.18 IC5.44
A10
  Top 0.152: U$2.12 33.78,8.38 32.51,9.65 32.51,14.35 33.78,15.62 J2.12 33.78,39.24 35.05,40.51 IC5.45
A11
  Top 0.152: U$2.13 36.32,8.38 35.05,9.65 35.05,14.35 36.32,15.62 J2.13 36.32,38.23 38.86,40.77 38.86,43.18 IC5.50
A12
  Top 0.152: U$2.14 38.86,8.38 37.59,9.65 37.59,14.35 38.86,15.62 J2.14 38.86,38.23 41.4,40.77 41.4,43.18 IC5.52
A13
  Top 0.152: U$2.15 41.4,8.38 40.13,9.65 40.13,14.35 41.4,15.62 J2.15 41.4,38.1 42.67,39.37 IC5.51
A14
  Top 0.152: U$2.16 43.94,8.38 42.67,9.65 42.67,19.81 43.94,21.08 J2.16 43.94,45.72 IC5.57
A15
  Top 0.152: U$2.17 46.48,8.38 45.21,9.65 45.21,14.35 46.48,15.62 J2.17 46.48,43.18 IC5.55
CLK25M
  Top 0.152: CLOCK.5 50.8,72.39 49.15,74.04 35.56,74.04 35.05,73.53 IC5.83
D0
  Top 0.152: J1.2 8.38,14.86 9.65,16.13 9.65,39.12 8.38,40.39 8.38,64.26 13.97,69.85 IC5.12
  Bottom 0.152: U$2.49 J1.2
D1
  Top 0.152: J1.3 10.92,14.73 12.19,16 12.19,39.24 10.92,40.51 10.92,62.48 14.48,66.04 18.54,66.04 IC5.17
  Bottom 0.152: U$2.48 J1.3
D2
  Top 0.152: J1.4 13.46,14.73 14.73,16 14.73,39.12 13.59,40.26 13.59,60.2 15.62,62.23 IC5.18
  Bottom 0.152: U$2.47 J1.4
D3
  Top 0.152: J1.5 16,14.73 17.27,16 17.27,39.24 15.88,40.64 15.88,56.13 16.89,57.15 IC5.22
  Bottom 0.152: U$2.46 J1.5
D4
  Top 0.152: J1.6 18.54,14.73 19.81,16 19.81,39.37 18.67,40.51 18.67,43.31 IC5.34
  Bottom 0.152: U$2.45 J1.6
D5
  Top 0.152: J1.7 21.08,14.73 22.35,16 22.35,38.99 21.08,40.26 21.08,43.18 IC5.36
  Bottom 0.152: U$2.44 J1.7
D6
  Top 0.152: J1.8 23.62,14.73 24.89,16 24.89,39.24 23.62,40.51 23.62,46.1 22.73,46.99 IC5.31
  Bottom 0.152: U$2.43 J1.8
D7
  Top 0.152: J1.9 26.16,14.73 27.43,16 27.43,39.24 26.16,40.51 26.16,43.18 IC5.40
  Bottom 0.152: U$2.42 J1.9
DMA_IN
  Bottom 0.152: U$2.27 J1.24
GND  (via drill 0.35)
  Bottom 0.152: 66.8,11.56 J1.25
  Bottom 1.27: U$2.26 66.8,11.56
  other vias: 24.77,64.9 24.89,49.91 39.5,63.5
  pour Bottom: -1.14,78.87 80.14,78.87 80.14,7.75 70.36,7.75 69.22,8.89 3.56,8.89 1.91,7.24 -1.14,7.24
  pour Top: -2.41,80.14 81.41,80.14 81.41,7.75 70.36,7.75 69.22,8.89 3.56,8.89 1.91,7.24 -2.41,7.24
INT_IN
  Bottom 0.152: U$2.28 J1.23
N$1
  Bottom 0.152: IC5.75 45.21,74.55 46.23,75.56 69.34,75.56 69.85,75.06 TEST2-3-4.3
N$2  (via drill 0.35)
  Top 0.152: v58.42,33.27 58.42,35.43 57.91,35.94 RDY.A
  Bottom 0.152: R2.1 v58.42,33.27
N$3
  Bottom 0.152: IC5.76 46.48,71.12 71.63,71.12 72.39,71.88 TEST2-3-4.2
N$4
  Bottom 0.152: U$2.29 J1.22
N$5
  Bottom 0.152: IC5.77 42.67,74.93 44.32,76.58 74.3,76.58 74.93,75.95 TEST2-3-4.1
N$8  (via drill 0.35)
  Top 0.152: v72.9,59.69 71.34,59.69 USB-C.A5
  Bottom 0.152: R22.2 v72.9,59.69
N$10  (via drill 0.35)
  Top 0.152: USB.A v73.66,68.58
  Bottom 0.152: v73.66,68.58 R63.1
N$20  (via drill 0.35)
  Top 0.152: v72.9,62.36 72.55,62.71 USB-C.B5
  Bottom 0.152: R20.2 74.11,62.36 v72.9,62.36
N$27
  Top 0.152: J2.22 59.18,15.62 57.91,14.35 57.91,9.65 59.18,8.38 U$2.22
N$28
  Top 0.152: J2.23 61.72,21.08 60.45,19.81 60.45,9.65 61.72,8.38 U$2.23
N$29
  Top 0.152: J2.24 64.26,21.08 62.99,19.81 62.99,9.65 64.26,8.38 U$2.24
N$30
  Bottom 0.152: U$2.30 J1.21
N$32
  Bottom 0.152: U$2.32 J1.19
N$33
  Bottom 1.27: U$2.33 J1.18
N$34
  Bottom 1.27: U$2.34 J1.17
N$36
  Bottom 0.152: U$2.36 J1.15
N$37
  Bottom 0.152: U$2.37 J1.14
N$50
  Bottom 1.27: U$2.50 J1.1
PHI0
  Top 0.152: J1.11 31.24,14.48 32.51,15.75 32.51,39.24 33.78,40.51 33.78,43.18 IC5.46
  Bottom 0.152: U$2.40 J1.11
PHI1
  Top 0.152: J1.13 36.32,14.35 37.59,15.62 37.59,38.23 40.13,40.77 IC5.49
  Bottom 0.152: U$2.38 J1.13
R/!W
  Top 0.152: U$2.18 49.02,8.38 47.75,9.65 47.75,14.35 49.02,15.62 J2.18 49.02,38.35 47.75,39.62 IC5.54
RDY
  Top 0.152: U$2.21 56.64,8.38 55.37,9.65 55.37,14.35 56.64,15.62 J2.21 56.64,45.59 52.7,49.53 IC5.58
  Bottom 0.152: R2.2 58.42,28.32 56.64,26.54 J2.21
SD0
  Top 0.152: IC20.1 52.42,58.84 50.16,61.09 46.35,61.09 IC5.69
SD1
  Top 0.152: IC20.5 51.84,56.23 49.91,58.17 46.1,58.17 45.85,58.42 40.51,58.42 38.86,60.07 38.86,71.12 IC5.79
SD2
  Top 0.152: IC20.3 51.56,57.53 50.55,58.55 46.35,58.55 IC5.67
SD3
  Top 0.152: IC20.11 51.42,52.34 50.42,53.34 46.61,53.34 45.34,54.61 IC5.63
SD4
  Top 0.152: IC20.2 51.92,58.19 49.4,60.71 46.1,60.71 45.85,60.96 41.66,60.96 40.13,62.48 IC5.80
SD5
  Top 0.152: IC20.9 52.41,53.63 49.99,56.06 46.3,56.06 IC5.65
SD6
  Top 0.152: IC20.10 51.79,52.98 49.15,55.63 46.1,55.63 45.85,55.88 38.1,55.88 36.32,57.66 36.32,71.12 IC5.81
SD7
  Top 0.152: IC20.6 51.6,55.59 50.04,57.15 IC5.64
SYNC
  Top 0.152: J1.12 33.78,14.48 35.05,15.75 35.05,39.24 36.32,40.51 36.32,43.18 IC5.48
  Bottom 0.152: U$2.39 J1.12
TCK
  Bottom 0.152: IC5.62 50.93,54.61 58.55,46.99 64.77,46.99 | JTAG.1 67.56,46.1 66.67,46.99 64.77,46.99 | R51.1 64.77,46.99
TDI
  Bottom 0.152: IC5.14 13.34,67.31 8.89,62.87 8.89,36.83 11.43,34.29 58.42,34.29 60.07,35.94 JTAG.9 72.08,35.88 72.07,35.87 R54.2
TDO
  Bottom 0.152: IC5.71 46.48,63.5 56.64,63.5 60.33,59.82 60.33,49.4 61.21,48.51 72.01,48.51 73.28,47.24 73.28,44.83 JTAG.3 71.5,44.07 R53.2
TEST1
  Bottom 0.152: IC5.56 R1.1 53.21,46.93 TEST1.1
TMS
  Bottom 0.152: IC5.23 18.54,55.88 12.95,55.88 11.56,54.48 11.56,37.72 13.21,36.07 56.64,36.07 61.59,41.02 68.58,41.02 | 68.58,41.02 JTAG.5 | R52.2 68.58,41.02
USB_LED
  Bottom 0.152: IC5.74 51.44,69.85 52.7,68.58 R63.2
USB_WR
  Top 0.152: IC20.14 51.22,50.38 50.8,50.8 46.48,50.8 IC5.61
USBDM
  Top 0.152: IC20.16 61.2,51.03 arc90 60.96,50.8 60.96,50.29 arc90 61.27,49.98 64.05,49.98 arc90 65.76,51.69 65.76,59.06 arc-90 66.91,60.21 USB-C.B7 72.4,60.21 72.52,60.33 72.52,61.09 72.39,61.21 USB-C.A7
USBDP
  Top 0.152: IC20.15 64.02,50.38 arc90 65.46,51.82 65.46,59.18 arc-90 66.98,60.71 70.23,60.71 | 70.23,60.71 USB-C.A6 | USB-C.B6 70.35,61.71 70.23,61.59 70.23,60.71
VBUS
  Top 0.152: USB-C.B4_A9 72.08,63.36 72.25,63.2 73.84,63.2 arc-90 74.04,62.99 74.04,58.93 arc-90 73.84,58.73 72.25,58.73 72.08,58.56 USB-C.A4_B9

### Text on the board
tNames: Mandatory | T2 | T3 | T4 | g (Go) / h (Halt) / b (Bump) / s (Toggle SYNC) / <space> (Step) | !IOSEL | A0 | A1 | A2 | A3 | A4 | A5 | A6 | A7 | A8 | A9 | A10 | A11 | A12 | A13 | A14 | A15 | R/!W | !CLKEN | !IOSTRB | RDY | !DMA | INT OUT | DMA OUT | +5V | v1.1 | USB Probe | +12V | D0 | D1 | D2 | D3 | D4 | D5 | D6 | D7 | !DEV | PHI0 | SYNC | PHI1 | Q3 | 7M | !ENKBD | -5V | -12V | !INH | !RES | !IRQ | !NMI | INT IN | DMA IN | GND